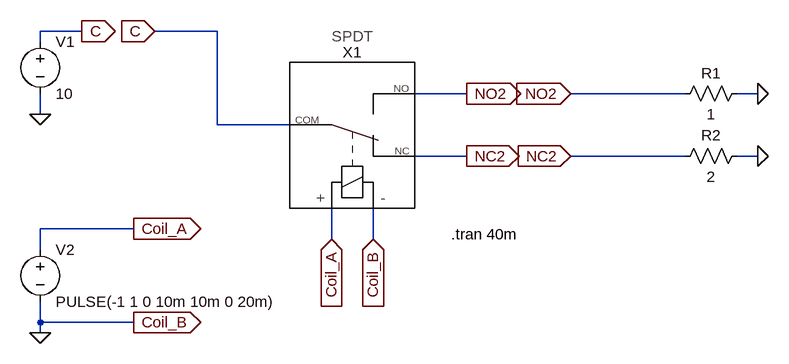
[diagram p0: schematic relay_test_spdt.asc]
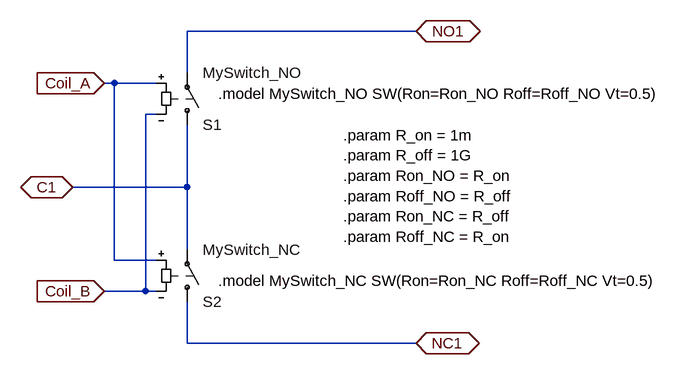
[diagram p1: sub-circuit relay_spdt.asc]
relay_test_spdt.asc, the LTspice schematic file:
Version 4
SHEET 1 1028 896
WIRE -112 16 -176 16
WIRE 96 16 0 16
WIRE -176 32 -176 16
WIRE 480 112 400 112
WIRE 816 112 640 112
WIRE 928 112 896 112
WIRE -176 144 -176 112
WIRE 96 160 96 16
WIRE 208 160 96 160
WIRE 480 208 400 208
WIRE 816 208 640 208
WIRE 928 208 896 208
WIRE -32 320 -176 320
WIRE 272 336 272 288
WIRE 336 336 336 288
WIRE -176 352 -176 320
WIRE -176 464 -176 432
WIRE -32 464 -176 464
WIRE -176 480 -176 464
FLAG -176 144 0
FLAG -112 16 C
IOPIN -112 16 Out
FLAG 640 112 NO2
IOPIN 640 112 In
FLAG 928 112 0
FLAG -32 320 Coil_A
IOPIN -32 320 Out
FLAG -32 464 Coil_B
IOPIN -32 464 Out
FLAG 272 336 Coil_A
IOPIN 272 336 In
FLAG 336 336 Coil_B
IOPIN 336 336 In
FLAG 640 208 NC2
IOPIN 640 208 In
FLAG 928 208 0
FLAG 0 16 C
IOPIN 0 16 In
FLAG 480 208 NC2
IOPIN 480 208 Out
FLAG 480 112 NO2
IOPIN 480 112 Out
FLAG -176 480 0
SYMBOL voltage -176 16 R0
WINDOW 123 0 0 Left 0
WINDOW 39 0 0 Left 0
SYMATTR InstName V1
SYMATTR Value 10
SYMBOL res 800 128 R270
WINDOW 0 32 56 VTop 2
WINDOW 3 0 56 VBottom 2
SYMATTR InstName R1
SYMATTR Value 1
SYMBOL voltage -176 336 R0
WINDOW 123 0 0 Left 0
WINDOW 39 0 0 Left 0
SYMATTR InstName V2
SYMATTR Value PULSE(-1 1 0 10m 10m 0 20m)
SYMBOL res 800 224 R270
WINDOW 0 32 56 VTop 2
WINDOW 3 0 56 VBottom 2
SYMATTR InstName R2
SYMATTR Value 2
SYMBOL Relay_SPDT 304 176 R0
SYMATTR InstName X1
TEXT 456 328 Left 2 !.tran 40m

relay_spdt.asc, the sub-circuit schematic file:
Version 4
SHEET 1 988 680
WIRE 592 -64 240 -64
WIRE 240 0 240 -64
WIRE 128 16 112 16
WIRE 192 16 128 16
WIRE 192 64 176 64
WIRE 240 176 240 80
WIRE 240 176 64 176
WIRE 240 272 240 176
WIRE 128 288 128 16
WIRE 192 288 128 288
WIRE 176 336 176 64
WIRE 176 336 112 336
WIRE 192 336 176 336
WIRE 240 416 240 352
WIRE 592 416 240 416
FLAG 592 -64 NO1
IOPIN 592 -64 BiDir
FLAG 592 416 NC1
IOPIN 592 416 BiDir
FLAG 64 176 C1
IOPIN 64 176 BiDir
FLAG 112 16 Coil_A
IOPIN 112 16 In
FLAG 112 336 Coil_B
IOPIN 112 336 In
SYMBOL sw 240 96 M180
SYMATTR InstName S1
SYMATTR Value MySwitch_NO
SYMBOL sw 240 368 M180
SYMATTR InstName S2
SYMATTR Value MySwitch_NC
TEXT 288 32 Left 2 !.model MySwitch_NO SW(Ron=Ron_NO Roff=Roff_NO Vt=0.5)
TEXT 288 320 Left 2 !.model MySwitch_NC SW(Ron=Ron_NC Roff=Roff_NC Vt=0.5)
TEXT 480 96 Left 2 !.param R_on = 1m\n.param R_off = 1G\n.param Ron_NO = R_on\n.param Roff_NO = R_off\n.param Ron_NC = R_off\n.param Roff_NC = R_on

The netlist it stands for:
* relay_test_spdt.asc
V1 C 0 10
R1 NO2 0 1
V2 Coil_A 0 PULSE(-1 1 0 10m 10m 0 20m)
R2 NC2 0 2
XX1 Coil_A 0 C NO2 NC2 relay_spdt

* block symbol definitions
.subckt relay_spdt Coil_A Coil_B C1 NO1 NC1
S1 C1 NO1 Coil_A Coil_B MySwitch_NO
S2 NC1 C1 Coil_A Coil_B MySwitch_NC
.model MySwitch_NO SW(Ron=Ron_NO Roff=Roff_NO Vt=0.5)
.model MySwitch_NC SW(Ron=Ron_NC Roff=Roff_NC Vt=0.5)
.param R_on = 1m
.param R_off = 1G
.param Ron_NO = R_on
.param Roff_NO = R_off
.param Ron_NC = R_off
.param Roff_NC = R_on
.ends relay_spdt

.tran 40m
.backanno
.end